# Altium project DC-DC_BuckBoost.PrjPcb (part 2 of 2)
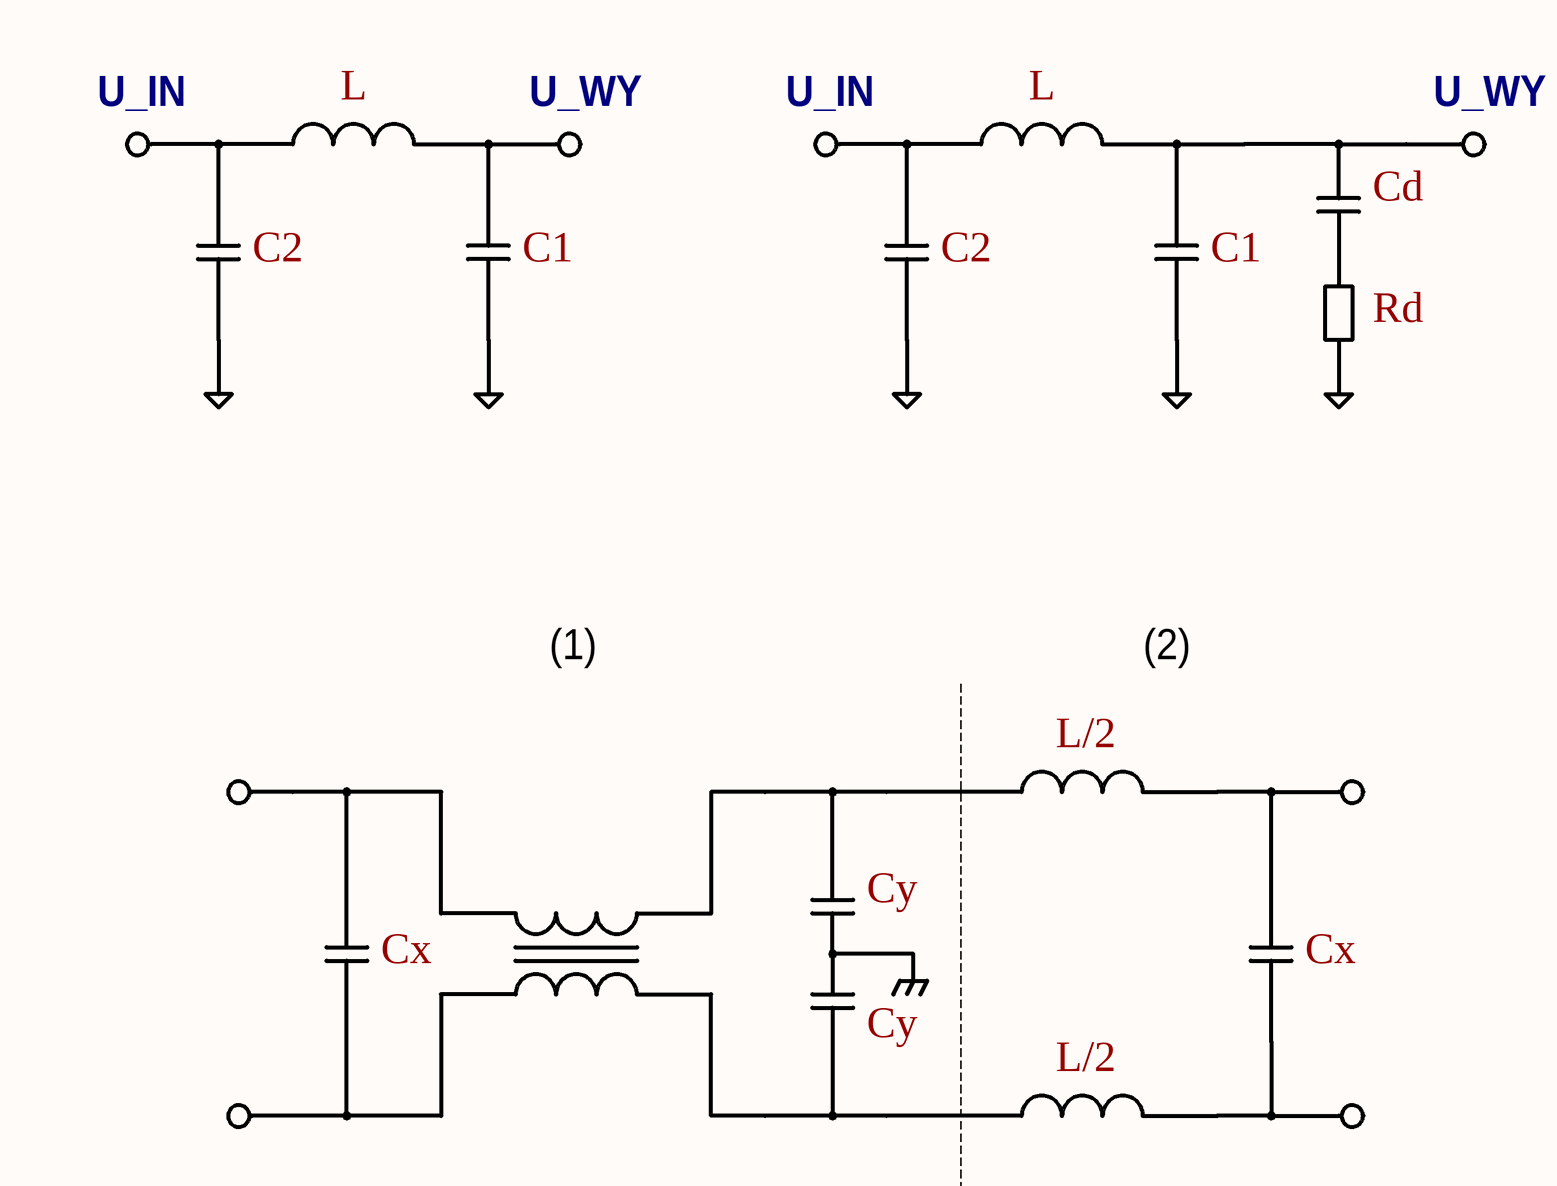
[diagram p20: Drawing.SchDoc, bottom right]

## Nets that join several sheets
+5: Output meas/AMC3302 circuit (FB401A.1), Output meas/AMC3330 circuit (FB301A.1), Input meas/AMC3302 circuit (FB401B.1), Input meas/AMC3330 circuit (FB301B.1), choke_current_meas (FB1200.2 FB1201.2), power_supply (L801.2 R801.1 U801.3), isolator (FB901.2), microcontroller (U1101.18)
+5_ISO: Output meas/Protection (R203A.1), Input meas/Protection (R203B.1), full_bridge (FB601.1 FB602.1), H-bridge/Choke voltage (FB1001A.1), power_supply (C802.1 L802.2 R802.1), isolator (FB902.1 U901.10), PWM isolation/PWM1and2 (FB1001B.1), PWM isolation/PWM3and4 (FB1001C.1)
GND: main (J7.1), Output meas/AMC3302 circuit (5 pins), Output meas/AMC3330 circuit (5 pins), Input meas/AMC3302 circuit (5 pins), Input meas/AMC3330 circuit (5 pins), choke_current_meas (7 pins), power_supply (C801.2 D801.2 U801.1), isolator (C901.1 C903.2 U901.2 U901.8), microcontroller (14 pins)
ISO_GND: main (J5.1), Output meas/AMC3330 circuit (9 pins), Output meas/Protection (9 pins), Input meas/AMC3330 circuit (9 pins), Input meas/Protection (9 pins), input_filter (C501.2 C502.2 C503.2), full_bridge (13 pins), H-bridge/Choke voltage (8 pins), output_filter (6 pins), power_supply (C802.2 D802.2 U801.7), isolator (C902.1 C904.2 U901.9 U901.15), PWM isolation/PWM1and2 (8 pins), PWM isolation/PWM3and4 (8 pins), EMI_filter (C103.2 C105.2 L103.2)
PE: main (J3.1), EMI_filter (C101.2 C104.1)
V_IN: main (J1.1), EMI_filter (F101.1)
V_OUT: main (J4.1), Output meas/AMC3302 circuit (R403A.2)
VCC: main (J6.1), power_supply (C801.1 L801.1)
Choke+: full_bridge (5 pins), choke_current_meas (U1200.1 U1200.2)
Choke-: full_bridge (U602.8), choke_current_meas (U1200.3 U1200.4)
ChokeCurrent_N: choke_current_meas (R1203.1 U1201.5), microcontroller (U1101.54)
ChokeCurrent_P: choke_current_meas (R1200.1 U1201.4), microcontroller (U1101.66)
FltrIn: Input meas/AMC3302 circuit (R403B.2), input_filter (C501.1 L501.1)
incurrent_N: Input meas/AMC3302 circuit (C410B.1 R406B.1), microcontroller (U1101.35)
incurrent_P: Input meas/AMC3302 circuit (C410B.2 R405B.1), microcontroller (U1101.36)
involtage_N: Input meas/AMC3330 circuit (C314B.1 R310B.1), microcontroller (U1101.30)
involtage_P: Input meas/AMC3330 circuit (C314B.2 R309B.1), microcontroller (U1101.28)
ISO_PWM1: full_bridge (U601.4), isolator (U901.12), PWM isolation/PWM3and4 (R1004C.2)
ISO_PWM2: full_bridge (U601.5), isolator (U901.11), PWM isolation/PWM3and4 (R1001C.2)
ISO_PWM3: full_bridge (U602.5), isolator (U901.13), PWM isolation/PWM1and2 (R1004B.2)
ISO_PWM4: full_bridge (U602.4), isolator (U901.14), PWM isolation/PWM1and2 (R1001B.2)
outcurrent_N: Output meas/AMC3302 circuit (C410A.1 R406A.1), microcontroller (U1101.53)
outcurrent_P: Output meas/AMC3302 circuit (C410A.2 R405A.1), microcontroller (U1101.72)
OutFltr: Output meas/Protection (R201A.1 U201A.17), output_filter (C705.1 C706.1 L701.2)
outvoltage_N: Output meas/AMC3330 circuit (C314A.1 R310A.1), microcontroller (U1101.56)
outvoltage_P: Output meas/AMC3330 circuit (C314A.2 R309A.1), microcontroller (U1101.64)
PWM1: isolator (U901.5), microcontroller (U1101.71)
PWM2: isolator (U901.6), microcontroller (U1101.52)
PWM3: isolator (U901.4), microcontroller (U1101.59)
PWM4: isolator (U901.3), microcontroller (U1101.61)
Return: main (J2.1), EMI_filter (D101.2 L102.2)
TP1: full_bridge (C608.2 C610.1 R601.2 R603.1), H-bridge/Choke voltage (R1004A.2)
TP2: full_bridge (C609.2 C611.1 R602.2 R604.1), H-bridge/Choke voltage (R1001A.2)
VCCFltr: Input meas/Protection (R201B.1 U201B.17), EMI_filter (C103.1 L101.2 R101.1)
VCCProt: Output meas/AMC3302 circuit (R403A.1), Output meas/AMC3330 circuit (C302A.1 R301A.1), Output meas/Protection (6 pins)
VCCProt: Input meas/AMC3302 circuit (R403B.1), Input meas/AMC3330 circuit (C302B.1 R301B.1), Input meas/Protection (6 pins)
Vin: input_filter (C502.1 L501.2 R501.1), full_bridge (C601.1 C602.1 C603.1 U601.1)
Vout: full_bridge (U602.1), output_filter (5 pins)